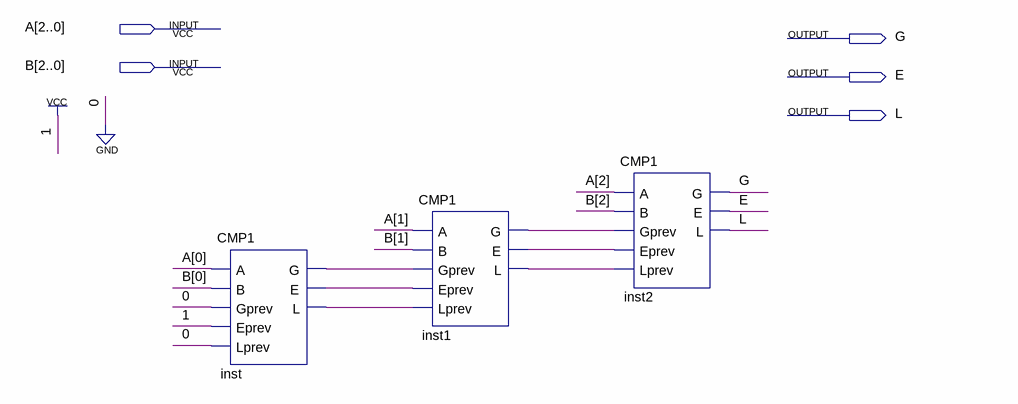
[diagram p0: schematic sheet]
// Quartus schematic CMP3.bdf as structural Verilog: 3 symbols, 5 pins
module CMP3 (
  input  [2:0] A,
  input  [2:0] B,
  output G,
  output E,
  output L
);

  wire inst1_e, inst1_g, inst1_l, inst_e, inst_g, inst_l;

  CMP1 inst (.A(A[0]), .B(B[0]), .Gprev(1'b0), .Eprev(1'b1), .Lprev(1'b0), .G(inst_g), .E(inst_e), .L(inst_l));
  CMP1 inst1 (
    .A(A[1]), .B(B[1]), .Gprev(inst_g), .Eprev(inst_e), .Lprev(inst_l), .G(inst1_g), .E(inst1_e), .L(inst1_l));
  CMP1 inst2 (.A(A[2]), .B(B[2]), .Gprev(inst1_g), .Eprev(inst1_e), .Lprev(inst1_l), .G(G), .E(E), .L(L));
endmodule
